# Altium schematic sheet SH2 - 17V BUCK CONVERTER.SchDoc: 17V Buck Converter
size B; Engineer: Rishith Bomman; Organization: UW Robotics; Address1: 200 University Avenue; Address2: Waterloo; Address3: Ontario; Address4: Canada N2L 3G6; DocumentNumber: 2; Revision: 3; SheetNumber: 2; SheetTotal: 9
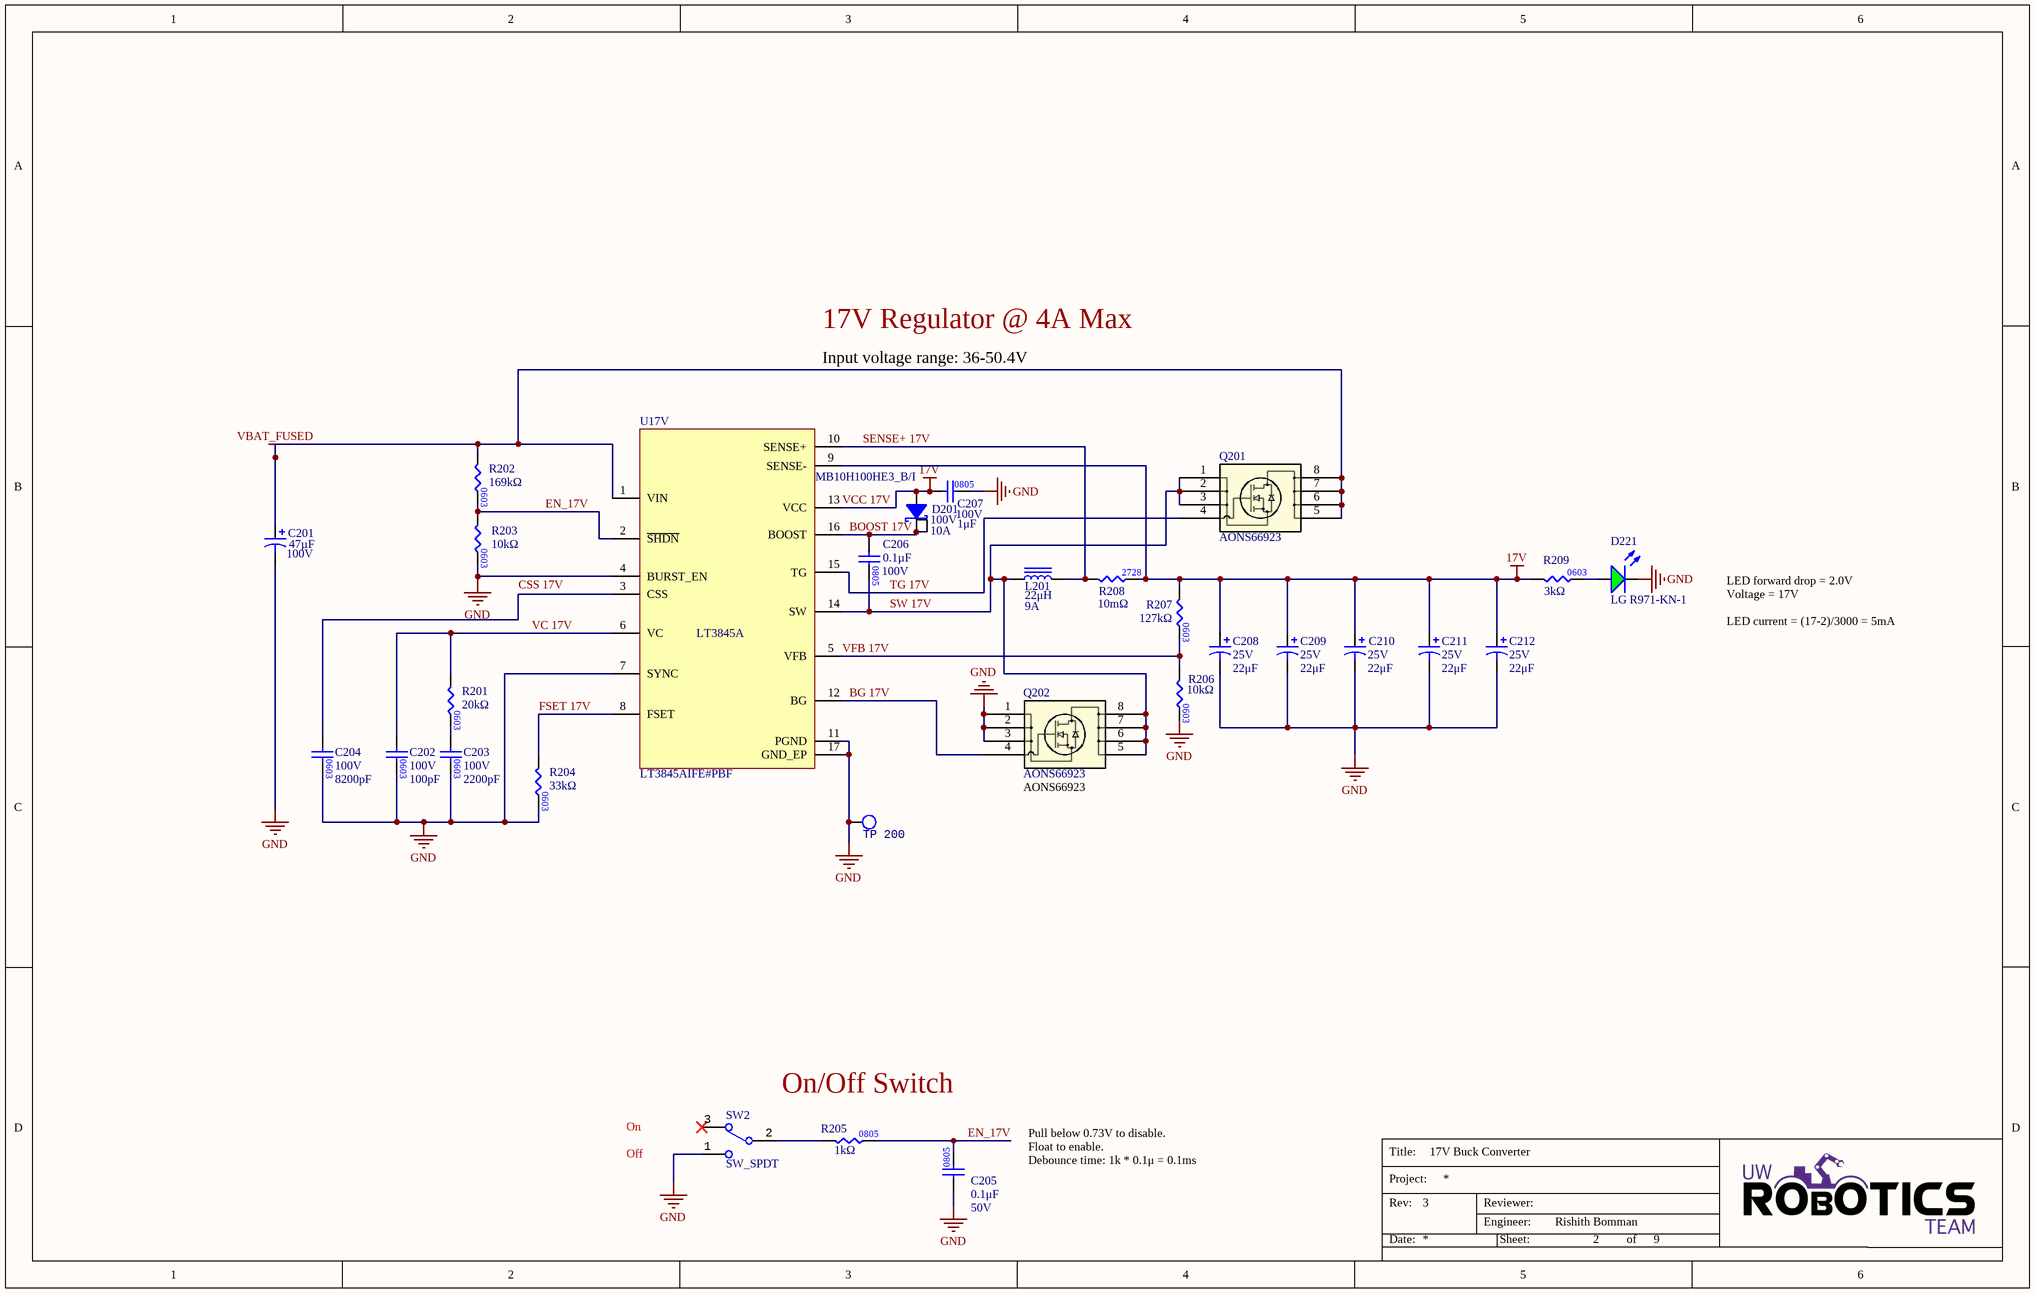
[diagram p0: SH2 - 17V BUCK CONVERTER.SchDoc]

## Parts
C201  value 47µF  Voltage Rating: 100V  [CAP_UCD_10X10_NCH-M]  (hidden comment: CAP_47uF_100V_ALUM_1)
C202  value 100pF  Voltage Rating: 100V  [CAP0603]  (hidden comment: CAP_100pF_100V_0603)
C203  value 2200pF  Voltage Rating: 100V  [CAP0603]  (hidden comment: CAP_2200pF_100V_0603)
C204  value 8200pF  Voltage Rating: 100V  [CAP0603]  (hidden comment: CAP_8200pF_100V_0603)
C205  value 0.1μF  Voltage Rating: 50V  [CAP2012]  (hidden comment: CAP_0.1uF_50V_0805)
C206  value 0.1µF  Voltage Rating: 100V  [CAP0805]  (hidden comment: CAP_0.1uF_100V_0805)
C207  value 1μF  Voltage Rating: 100V  [CAP2012]  (hidden comment: CAP_1uF_100V_0805)
C208  value 22μF  Voltage Rating: 25V  [CAP2917]  (hidden comment: CAP_22uF_25V_TANT)
C209  value 22μF  Voltage Rating: 25V  [CAP2917]  (hidden comment: CAP_22uF_25V_TANT)
C210  value 22μF  Voltage Rating: 25V  [CAP2917]  (hidden comment: CAP_22uF_25V_TANT)
C211  value 22μF  Voltage Rating: 25V  [CAP2917]  (hidden comment: CAP_22uF_25V_TANT)
C212  value 22μF  Voltage Rating: 25V  [CAP2917]  (hidden comment: CAP_22uF_25V_TANT)
D201  Forward Current: 10A  Manufacturer Part Number 1: MB10H100HE3_B/I  Vr (Max): 100V  [D-PAK3]  (hidden comment: DIO_SCHOTTKY_100V_5.5A)
D221  Manufacturer Part Number 1: LG R971-KN-1  [LED_0805_GREEN]  (hidden comment: LED_GREEN)
L201  Current Rating: 9A  Inductance: 22μH  [IND_BOURNS_SRP1265]  (hidden comment: IND_22uH_9A)
Q201  AONS66923  [DFN5X6_8L_EP1_P_AOS-L]
Q202  AONS66923  [DFN5X6_8L_EP1_P_AOS-L]
R201  value 20kΩ  [RES0603]  (hidden comment: RES_20kΩ_0603_1%)
R202  value 169kΩ  [RES0603]  (hidden comment: RES_169kΩ_0603_1%)
R203  value 10kΩ  [RES0603]  (hidden comment: RES_10kΩ_0603_5%)
R204  value 33kΩ  [RES0603]  (hidden comment: RES_33kΩ_0603_5%)
R205  value 1kΩ  [RES0805]  (hidden comment: RES_1kΩ_0805_1%_1)
R206  value 10kΩ  [RES0603]  (hidden comment: RES_10kΩ_0603_5%)
R207  value 127kΩ  [RES0603]  (hidden comment: RES_127kΩ_0603_1%)
R208  value 10mΩ  [STAC-CSS2725-099H_V]  (hidden comment: RES_10mΩ_2728_1%)
R209  value 3kΩ  [RES0603]  (hidden comment: RES_3kΩ_0603_1%)
SW2  SW_SPDT  [100SP1T1B4M2QE]
TP_200  TESTPOINT_LOOP  [TESTPOINT_LOOP]  (value not drawn)
U17V  BUCK_LT3845A  [LT3845AIFE#PBF]  (value not drawn)

## Nets
GND: C201.2 C202.2 C203.2 C204.2 C205.1 C207.2 C208.2 C209.2 C210.2 C211.2 C212.2 D221.2(K) Q202.1 Q202.2 Q202.3 R203.2 R204.2 R206.2 SW2.1 TP_200.1 U17V.4(BURST_EN) U17V.7(SYNC) U17V.11(PGND) U17V.17(GND_EP)
VBAT_FUSED: C201.1 Q201.5 Q201.6 Q201.7 Q201.8 R202.1 U17V.1(VIN)
VCC 17V: C207.1 C208.1 C209.1 C210.1 C211.1 C212.1 D201.2(Anode) R207.1 R208.2 R209.1 U17V.9(SENSE-) U17V.13(VCC)  [also labelled 17V]
BG 17V: Q202.4 U17V.12(BG)
BOOST 17V: C206.1 D201.1(Cathode) D201.3(Heatsink_(K)) U17V.16(BOOST)
EN_17V: C205.2 R202.2 R203.1 R205.2 U17V.2(~{SHDN})
FSET 17V: R204.1 U17V.8(FSET)
SENSE+ 17V: L201.2 R208.1 U17V.10(SENSE+)
SW 17V: C206.2 L201.1 Q201.1 Q201.2 Q201.3 Q202.5 Q202.6 Q202.7 Q202.8 U17V.14(SW)
TG 17V: Q201.4 U17V.15(TG)
VC 17V: C202.1 R201.1 U17V.6(VC)
VFB 17V: R206.1 R207.2 U17V.5(VFB)
NetC203_1: C203.1 R201.2
NetC204_1: C204.1 U17V.3(CSS)
NetD221_1: D221.1(A) R209.2
NetR205_1: R205.1 SW2.2

Not connected (* = marked no-connect by the designer): SW2 3*

## Notes on the sheet
- Input voltage range: 36-50.4V
- 17V Regulator @ 4A Max
- LED forward drop = 2.0V
  Voltage = 17V
  LED current = (17-2)/3000 = 5mA
- On/Off Switch
- Off
- On
- Pull below 0.73V to disable.
  Float to enable.
  Debounce time: 1k * 0.1μ = 0.1ms
- Labels drawn without touching a wire or pin: CSS 17V
- Title:
- Project:
- Date:
- Rev:
- Reviewer:
- Engineer:
- Sheet:
- of
- (in symbol BUCK_LT3845A) LT3845A
- (in symbol CAP_100pF_100V_0603) 0603
- (in symbol CAP_2200pF_100V_0603) 0603
- (in symbol CAP_8200pF_100V_0603) 0603
- (in symbol RES_3kΩ_0603_1%) 0603
- (in symbol RES_10mΩ_2728_1%) 2728
- (in symbol RES_20kΩ_0603_1%) 0603
- (in symbol RES_33kΩ_0603_5%) 0603
- (in symbol RES_127kΩ_0603_1%) 0603
- (in symbol RES_169kΩ_0603_1%) 0603

## Library data of the parts
C201 = CAP_47uF_100V_ALUM_1: CAP ALUM 47UF 20% 100V SMD; Manufacturer 1: Nichicon; Manufacturer Part Number 1: UUR2A470MNL1GS; Mounting Type: SMD; Package/Footprint: SMD; Supplier 1: Digi-Key; Supplier Part Number 1: 493-9589-1-ND
C202 = CAP_100pF_100V_0603: CAP CER 100PF 100V C0G/NP0 0603; Manufacturer Part Number 1: VJ0603A101JXAAC; Manufacturer 1: Vishay Vitramon; Dielectric: C0G, NP0; Supplier 1: Arrow Electronics; Supplier Part Number 1: 06031A101FAT2A
C203 = CAP_2200pF_100V_0603: CAP CER 2200PF 100V X7R 0603; Manufacturer Part Number 1: VJ0603A101JXAAC; Manufacturer 1: Vishay Vitramon; Dielectric: C0G, NP0; Supplier 1: Arrow Electronics; Supplier Part Number 1: 0603B222K101CT
C204 = CAP_8200pF_100V_0603: CAP CER 8200PF 100V X7R 0603; Manufacturer Part Number 1: VJ0603A101JXAAC; Manufacturer 1: Vishay Vitramon; Dielectric: C0G, NP0; Supplier 1: Arrow Electronics; Supplier Part Number 1: 06031C822KAT2A
C205 = CAP_0.1uF_50V_0805: CAP CER 0.1UF 50V X7R 0805; Manufacturer Part Number 1: GCM21BR71H104KA37K; Manufacturer 1: Murata Electronics; Package/Footprint: 0805; Supplier Part Number 1: 490-8049-1-ND; Supplier 1: Digi-Key; Dielectric: X7R; LCSC Part #: C49678; Mounting Type: SMD
C206 = CAP_0.1uF_100V_0805: CAP CER 0.1UF 100V X7R 0805; Manufacturer 1: TDK Corporation; Manufacturer Part Number 1: C2012X7R2A104K125AA; Package: 0805; Supplier 1: Digi-Key; Supplier 2: Arrow Electronics; Supplier Part Number 1: 445-1418-1-ND; Supplier Part Number 2: CL21B104KCFNNNE
C207 = CAP_1uF_100V_0805: CAP CER 1UF 100V X7S 0805; Manufacturer Part Number 1: C0805C224K5RACTU; Manufacturer 1: KEMET; Dielectric: X7R; Mounting Type: SMD; Package: 0805; LCSC Part #: C5378; Supplier 1: Newark; Supplier Part Number 1: 79AH1080
C208-C212 = CAP_22uF_25V_TANT: CAP TANT 22UF 20% 25V 2917; Manufacturer Part Number 1: F971A106MBAHT3; Manufacturer 1: AVX Corporation; Supplier 1: Arrow Electronics; Supplier Part Number 1: TPSD226M025R0100
D201 = DIO_SCHOTTKY_100V_10A: DIODE SCHOTTKY 100V 10A TO263AB; Manufacturer 1: Vishay General Semiconductor - Diodes Division; Package/Footprint: TO-263AB; Mounting Type: SMD; Supplier 1: Digi-Key; Supplier Part Number 1: 112-MB10H100HE3_B/ICT-ND
D221 = LED_GREEN: LED GREEN DIFFUSED 0805 SMD; Manufacturer 1: OSRAM; Forward Voltage Drop: 2.2V; Package/Footprint: 0805; Mounting Type: SMD; Supplier 1: Digi-Key; Supplier Part Number 1: 475-1410-1-ND; Supplier 2: Future Electronics; Supplier Part Number 2: 1152237
L201 = IND_22uH_9A: 22UH 20%  SMD POWER CHOKE; Manufacturer 1: Bourns Inc.; Manufacturer Part Number 1: SRP1265A-220M; DC Resistance (DCR): 37mOhms; Saturation Current: 12A; Inductance Tolerance: 20%; Mounting Type: SMD; Supplier 1: Arrow Electronics; Supplier Part Number 1: SRP1265A-220M
Q201 Q202 = NMOS_100V_15/47A_1: MOSFET N-CH 100V 15A/47A 8DFN; Mfr_Name: Alpha and Omega Semiconductor; Type: DEV; Copyright: Copyright (C) 2022 Ultra Librarian. All rights reserved.; Digi-Key_Part_Number_1: 785-1815-2-ND; Digi-Key_Part_Number_2: 785-1815-1-ND; Digi-Key_Part_Number_3: 785-1815-6-ND; RefDes: RefDes; Supplier 1: Digi-Key; Supplier Part Number 1: 785-1815-1-ND; Manufacturer_Part_Number: AONS66923
R201 = RES_20kΩ_0603_1%: RES 20K OHM 1% 1/10W 0603; Manufacturer 1: Yageo; Manufacturer Part Number 1: RC0603FR-0720KL; Supplier Part Number 1: 311-20.0KHRCT-ND; Supplier 1: Digi-Key
R202 = RES_169kΩ_0603_1%: RES 169K OHM 1% 1/10W 0603; Manufacturer 1: Yageo; Manufacturer Part Number 1: RC0603FR-07165KL; Supplier 1: Arrow Electronics; Supplier Part Number 1: RMCF0603FT169K
R203 R206 = RES_10kΩ_0603_5%: RES 10K OHM 5% 1/10W 0603; Manufacturer 1: Yageo; Manufacturer Part Number 1: RC0603JR-0710KL; Supplier Part Number 1: 311-10KGRCT-ND; Supplier 1: Digi-Key; Mounting Type: SMD; Package: 0603
R204 = RES_33kΩ_0603_5%: RES 33K OHM 5% 1/10W 0603; Manufacturer 1: Yageo; Manufacturer Part Number 1: RC0603JR-0743KL; Supplier 1: Arrow Electronics; Supplier Part Number 1: CR0603-JW-333ELF
R205 = RES_1kΩ_0805_1%_1: RES 1K OHM 1% 1/8W 0805; Manufacturer 1: Yageo; Manufacturer Part Number 1: RC0805FR-071KL; Supplier Part Number 1: 311-1.00KCRCT-ND; Supplier 1: Digi-Key; LCSC Part #: C17513; Mounting Type: SMD; Package: 0805
R207 = RES_127kΩ_0603_1%: RES 127K OHM 1% 1/10W 0603; Manufacturer 1: Stackpole Electronics Inc; Manufacturer Part Number 1: RMCF0603FT249K; Supplier 1: Arrow Electronics; Supplier Part Number 1: RC0603FR-07127KL
R208 = RES_10mΩ_2728_1%: RES 10mOHM 1% 4W 2728; Manufacturer 1: Yageo; Manufacturer Part Number 1: RC0603FR-07698KL; Supplier Part Number 1: CSSH2728FT10L0DKR-ND; Supplier 1: Digi-Key
R209 = RES_3kΩ_0603_1%: RES 3K OHM 1% 1/10W 0603; Manufacturer 1: Yageo; Manufacturer Part Number 1: RC0603FR-073KL; Supplier 1: Digi-Key; Supplier Part Number 1: 311-3.00KHRCT-ND
SW2 = SW_SPDT: SWITCH TOGGLE SPDT 5A 120V; Manufacturer 1: E-Switch; Voltage Rating (DC): 28V; Package/Footprint: TH; Supplier 1: Digi-Key; Manufacturer Part Number 1: 100SP1T1B4M2QE; Throw Configuration: SPDT; Supplier Part Number 1: EG2355-ND; Current Rating: 5A; Mounting Type: TH
TP_200 = TESTPOINT_LOOP: TESTPOINT THRUHOLE; Manufacturer 1: Keystone Electronics; Manufacturer Part Number 1: 5002; Package/Footprint: TH; Supplier Part Number 1: 36-5002-ND; Supplier 1: Digi-Key; Mounting Type: TH
U17V = BUCK_LT3845A: IC REG CTRLR BUCK 16TSSOP; Manufacturer 1: Analog Devices Inc.; Package/Footprint: 16-TSSOP-EP; Mounting Type: SMD; Supplier 1: Mouser; Supplier Part Number 1: 584-LT3845AIFE#PBF; Manufacturer Part Number 1: LT3845AIFE#PBF